# Altium schematic sheet Cegep-tabloid.schdoc: Cegep-tabloid
size Tabloid; ApprovedBy: APPROUVÉ PAR; Author: Javier Bolduc; Organization: Cegep Limoilou; Address1: 1300, 8e Avenue; Address2: Québec, QC; Address3: Canada; Address4: G1J 5L5; SheetNumber: 1; SheetTotal: 2
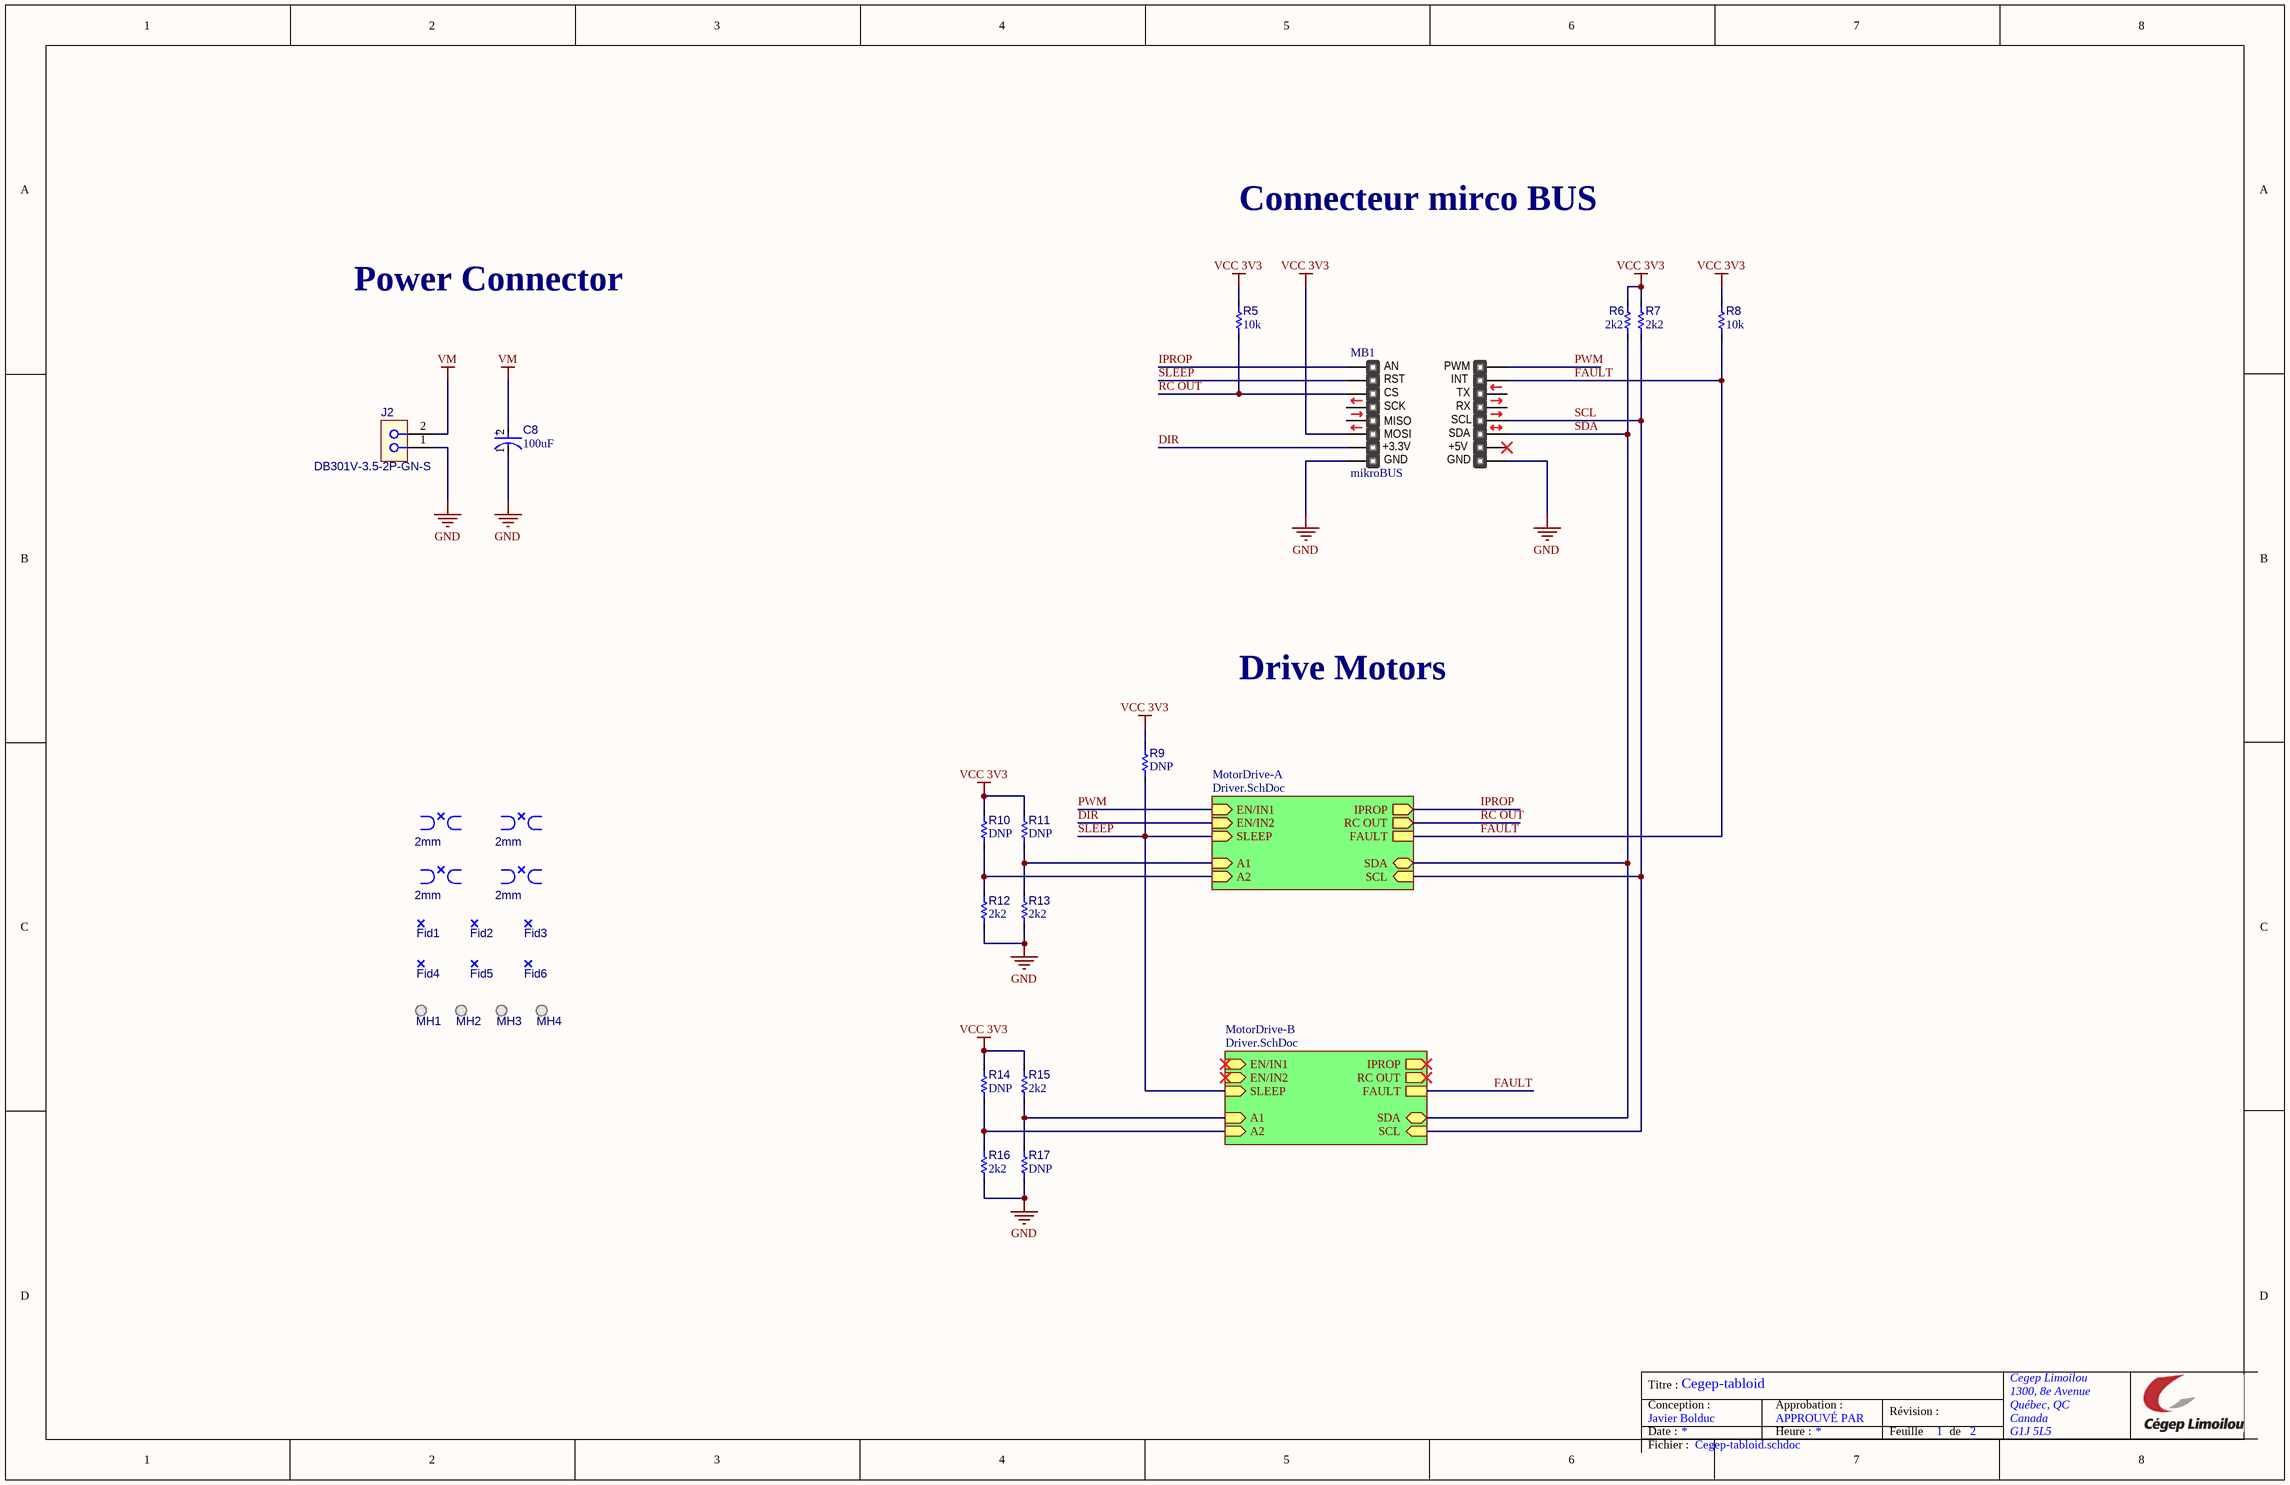
[diagram p0: Cegep-tabloid.schdoc]

## Parts
BRK1  value 2mm  [BK_CRACK1B_M]  (hidden comment: DNP)  (no BOM)
BRK2  value 2mm  [BK_CRACK1B_M]  (hidden comment: DNP)  (no BOM)
BRK3  value 2mm  [BK_CRACK1B_M]  (hidden comment: DNP)  (no BOM)
BRK4  value 2mm  [BK_CRACK1B_M]  (hidden comment: DNP)  (no BOM)
C8  value 100uF  [C_EL_D10MM-L11MM]  (hidden comment: CAP EL 100uF 63V 10MM)
Fid1  DNP  [FD_Fiducial]  (value not drawn)  (no BOM)
Fid2  DNP  [FD_Fiducial]  (value not drawn)  (no BOM)
Fid3  DNP  [FD_Fiducial]  (value not drawn)  (no BOM)
Fid4  DNP  [FD_Fiducial]  (value not drawn)  (no BOM)
Fid5  DNP  [FD_Fiducial]  (value not drawn)  (no BOM)
Fid6  DNP  [FD_Fiducial]  (value not drawn)  (no BOM)
J2  DB301V-3.5-2P-GN-S  [CONN_TERM_BLOCK_2POS_3mm5]
MB1  mikroBUS  [mikroBUS - Midi]
MH1  DNP  [MP_M-Hole_M2-NonPlated]  (value not drawn)  (no BOM)
MH2  DNP  [MP_M-Hole_M2-NonPlated]  (value not drawn)  (no BOM)
MH3  DNP  [MP_M-Hole_M2-NonPlated]  (value not drawn)  (no BOM)
MH4  DNP  [MP_M-Hole_M2-NonPlated]  (value not drawn)  (no BOM)
R5  value 10k  [R_1005[0402]]  (hidden comment: Res 10k 1% 0402)
R6  value 2k2  [R_1005[0402]]  (hidden comment: Res 2k2 1% 0402)
R7  value 2k2  [R_1005[0402]]  (hidden comment: Res 2k2 1% 0402)
R8  value 10k  [R_1005[0402]]  (hidden comment: Res 10k 1% 0402)
R9  value DNP  [R_1005[0402]]  (hidden comment: Res 2k2 1% 0402)  (no BOM)
R10  value DNP  [R_1005[0402]]  (hidden comment: Res 2k2 1% 0402)  (no BOM)
R11  value DNP  [R_1005[0402]]  (hidden comment: Res 2k2 1% 0402)  (no BOM)
R12  value 2k2  [R_1005[0402]]  (hidden comment: Res 2k2 1% 0402)
R13  value 2k2  [R_1005[0402]]  (hidden comment: Res 2k2 1% 0402)
R14  value DNP  [R_1005[0402]]  (hidden comment: Res 2k2 1% 0402)  (no BOM)
R15  value 2k2  [R_1005[0402]]  (hidden comment: Res 2k2 1% 0402)
R16  value 2k2  [R_1005[0402]]  (hidden comment: Res 2k2 1% 0402)
R17  value DNP  [R_1005[0402]]  (hidden comment: Res 2k2 1% 0402)  (no BOM)

## Sub-sheets
MotorDrive-A = Driver.SchDoc: RC OUT (out), A2 (in), A1 (in), SDA (bidir), SCL (in), FAULT, EN/IN1 (in), EN/IN2 (in), SLEEP (in), IPROP (out)
MotorDrive-B = Driver.SchDoc: RC OUT (out), A2 (in), A1 (in), SDA (bidir), SCL (in), FAULT, EN/IN1 (in), EN/IN2 (in), SLEEP (in), IPROP (out)

## Nets
GND: C8.1(C) J2.1 MB1.8(GND) MB1.9(GND) R12.2 R13.2 R16.2 R17.2
VCC 3V3: MB1.6(MOSI) R5.1 R6.1 R7.1 R8.1 R9.1 R10.1 R11.1 R14.1 R15.1
VM: C8.2(A) J2.2
DIR: MB1.7(3.3V) ; sheet MotorDrive-A/EN/IN2
FAULT: MB1.15(INT) R8.2 ; sheet MotorDrive-A/FAULT, sheet MotorDrive-B/FAULT
IPROP: MB1.1(AN) ; sheet MotorDrive-A/IPROP
PWM: MB1.16(PWM) ; sheet MotorDrive-A/EN/IN1
RC OUT: MB1.3(CS) R5.2 ; sheet MotorDrive-A/RC OUT
SCL: MB1.12(SCL) R7.2 ; sheet MotorDrive-A/SCL, sheet MotorDrive-B/SCL
SDA: MB1.11(SDA) R6.2 ; sheet MotorDrive-A/SDA, sheet MotorDrive-B/SDA
SLEEP: MB1.2(RST) R9.2 ; sheet MotorDrive-A/SLEEP, sheet MotorDrive-B/SLEEP
NetR10_2: R10.2 R12.1 ; sheet MotorDrive-A/A2
NetR11_2: R11.2 R13.1 ; sheet MotorDrive-A/A1
NetR14_2: R14.2 R16.1 ; sheet MotorDrive-B/A2
NetR15_2: R15.2 R17.1 ; sheet MotorDrive-B/A1

Not connected (* = marked no-connect by the designer): BRK1 1 2 3 4 5; BRK2 1 2 3 4 5; BRK3 1 2 3 4 5; BRK4 1 2 3 4 5; Fid1 1 2 3 4 5; Fid2 1 2 3 4 5; Fid3 1 2 3 4 5; Fid4 1 2 3 4 5; Fid5 1 2 3 4 5; Fid6 1 2 3 4 5; MB1 4(SCK) 5(MISO) 10(5V)* 13(TX) 14(RX)

## Notes on the sheet
- Connecteur mirco BUS
- Power Connector
- Drive Motors
- Titre :
- Conception :
- Date :
- Approbation :
- Heure :
- Révision :
- Feuille
- de
- Fichier :
- (in symbol CAP021) +
- (in symbol mikroBUS compatible add-on board) +3.3V; +5V

## Library data of the parts
BRK1-BRK4 = BK_BREAKOUT_2MM: Mouse Bites; Manufacturer_PN: DNP; RoHS: N/A; Technology: N/A
C8 = CAP021: Capacitor type EL; Manufacturer 1: HRK; Manufacturer Part Number 1: GVT1J107M1010CNVC; LibRef: CAP021; Tolerance: 20%; Rated Voltage: 63V; Dielectric: EL; Mounting Technology: SMT; Supplier 1: LCSC; Supplier Part Number 1: C2983410
Fid1-Fid6 = Fiducial: Fiducial for Pick&Place; Manufacturer_PN: DNP; Value: Fiducial for Pick&Place
J2 = CONN-3MM5-2POS-TERM-BLOCK: CONN TERM BLOCK 2POS 3.5mm pitch; Manufacturer 1: Dorabo; Supplier 1: LCSC; Supplier Part Number 1: C695629; Manufacturer Part Number 1: DB301V-3.5-2P-GN-S; Mounting Technology: TH
MB1 = mikroBUS compatible add-on board
MH1-MH4 = MH-2MM_NP: Mounting Hole 2mm non plated; Manufacturer Part Number 1: DNP; Value: Mounting Hole 2mm non plated; Supplier Part Number 1: N/A
R5 R8 = RES003: Resistor type 1; Manufacturer 1: Yageo; Manufacturer Part Number 1: RC0402FR-0710KL; LibRef: RES003; Puissance: 1/16W; Max Working Voltage: 50V; Tolerance: 1%; Mounting Technology: SMT; Supplier 1: LCSC; Supplier Part Number 1: C60490
R6 R7 R9-R17 = RES008: Resistor type 1; Manufacturer 1: Yageo; Manufacturer Part Number 1: RC0402FR-072K2L; LibRef: RES008; Code CEGEP: RES2.2KSM; Puissance: 1/16W; Max Working Voltage: 50V; Tolerance: 1%; Mounting Technology: SMT; Supplier 1: LCSC; Supplier Part Number 1: C114762; Supplier 2: Digi-Key; Supplier Part Number 2: 311-2.20KLRCT-ND